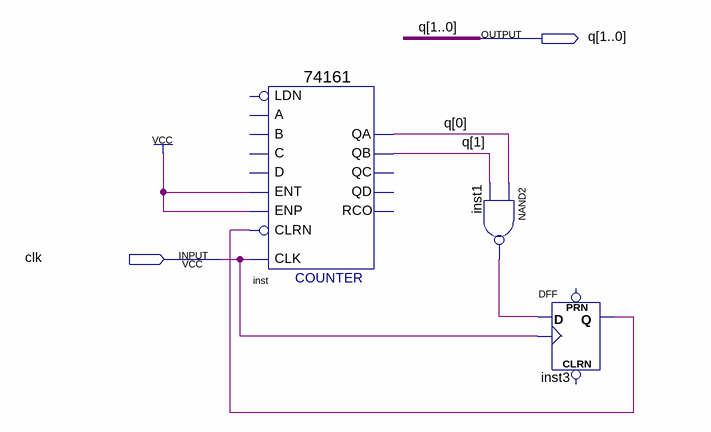
[diagram p0: schematic sheet]
// Quartus schematic counter.bdf as structural Verilog: 3 symbols, 2 pins
module counter (
  input  clk,
  output [1:0] q
);

  wire inst1_out, inst3_q;

  \74161  inst (
    .CLRN(inst3_q), .CLK(clk), .ENP(1'b1), .ENT(1'b1), .QB(q[1]), .QA(q[0]));  // open: LDN, A, D, B, C, QD, QC, RCO
  nand inst1 (inst1_out, q[0], q[1]);
  DFF inst3 (.CLK(clk), .D(inst1_out), .Q(inst3_q));  // open: CLRN, PRN
endmodule
